# Altium schematic sheet OPV_psu.SchDoc: OPV Power supply
size A4; DrawnBy: Watzek; Organization: HTL Hollabrunn; Address1: Abteilung Elektronik; Address2: Anton Ehrenfried-Straße 10; Address3: 2020 Hollabrunn; DocumentNumber: 03; Revision: 01; SheetNumber: 03; SheetTotal: 12; SPICEModelCacheVBIYTPZR: <root> / <DocumentId>VBIYTPZR</DocumentId> / <CacheFrame Number="0"> / <Model Name="cap" Kind="MDL"> / <Text>*Default semiconductor capacitor / .MODEL CAP C()</Text> / </Model> / </CacheFrame> / </root>
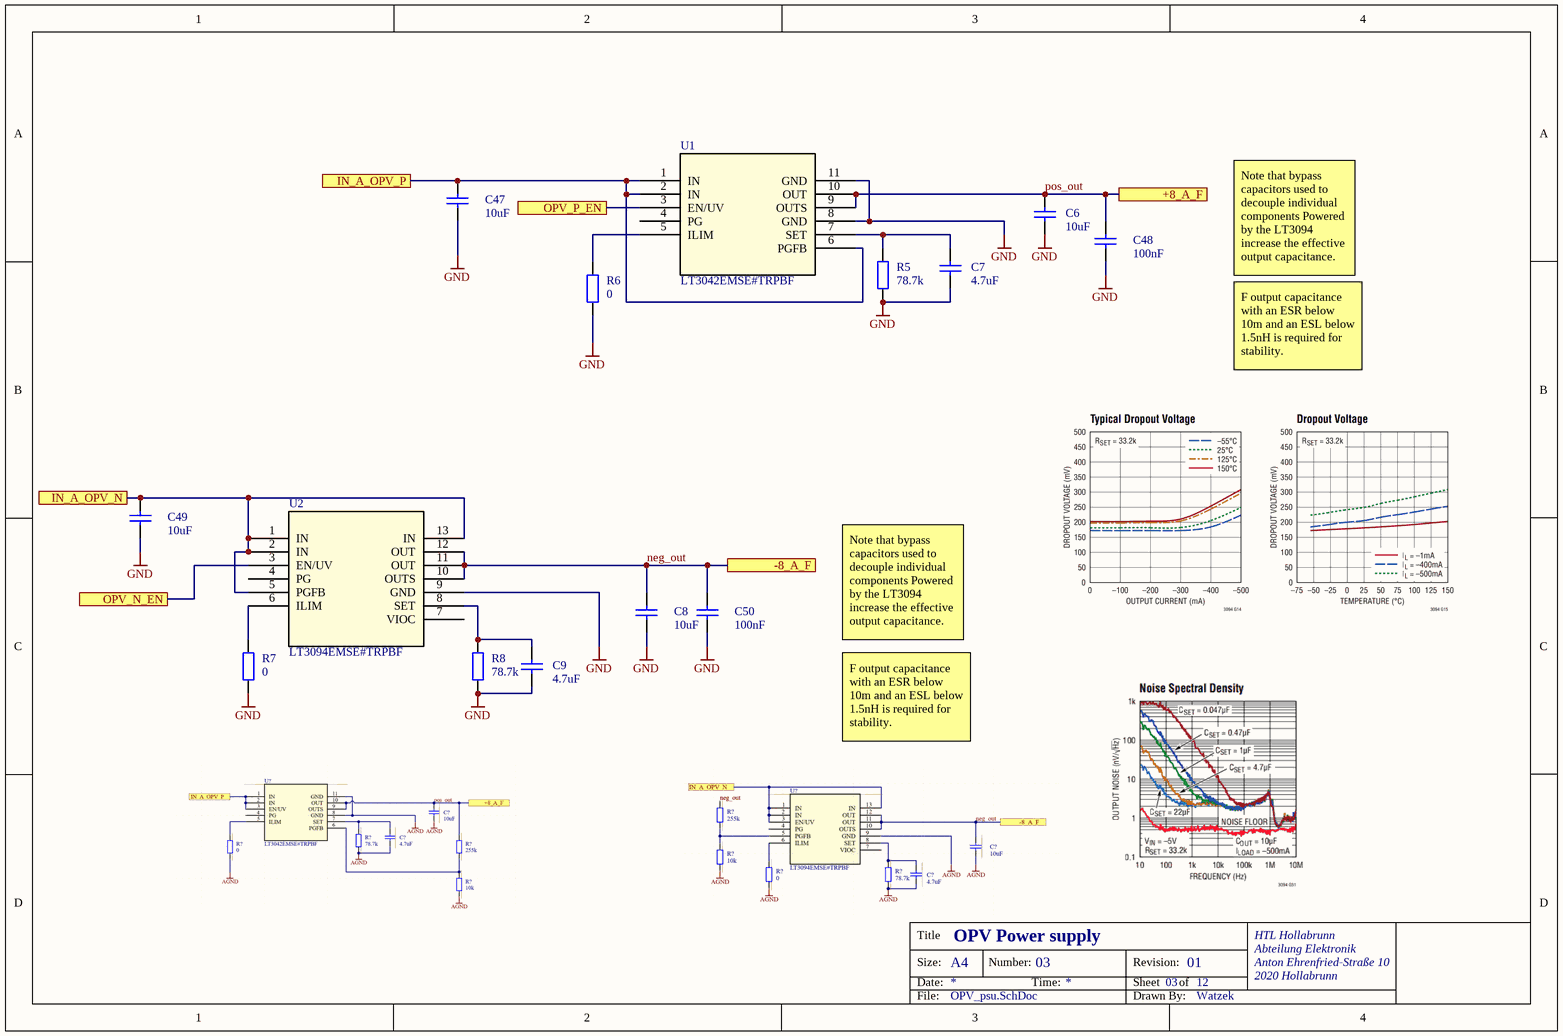
[diagram p0: OPV_psu.SchDoc]

## Parts
C6  10uF  [C1206-KUE]
C7  4.7uF  [C1206-KUE]
C8  10uF  [C1206-KUE]
C9  4.7uF  [C1206-KUE]
C47  10uF  [C1206-KUE]
C48  100nF  [C1206-KUE]
C49  10uF  [C1206-KUE]
C50  100nF  [C1206-KUE]
R5  78.7k  [C1206-KUE]
R6  0  [C1206-KUE]
R7  0  [C1206-KUE]
R8  78.7k  [C1206-KUE]
U1  LT3042EMSE#TRPBF  [05-08-1664_ADI]
U2  LT3094EMSE#TRPBF  [MSE_05-08-1666_ADI]

## Ports
+8_A_F, -8_A_F, IN_A_OPV_N, IN_A_OPV_P, OPV_N_EN, OPV_P_EN

## Nets
GND: C6.1 C7.1 C8.1 C9.1 C47.1 C48.1 C49.1 C50.1 R5.2 R6.2 R7.2 R8.2 U1.8(GND) U1.11(GND) U2.9(GND)
IN_A_OPV_N: C49.2 U2.1(IN) U2.2(IN) U2.5(PGFB) U2.13(IN) ; port IN_A_OPV_N
IN_A_OPV_P: C47.2 U1.1(IN) U1.2(IN) U1.6(PGFB) ; port IN_A_OPV_P
neg_out: C8.2 C50.2 U2.10(OUTS) U2.11(OUT) U2.12(OUT) ; port -8_A_F
OPV_N_EN: U2.3(EN/UV) ; port OPV_N_EN
OPV_P_EN: U1.3(EN/UV) ; port OPV_P_EN
pos_out: C6.2 C48.2 U1.9(OUTS) U1.10(OUT) ; port +8_A_F
NetC7_2: C7.2 R5.1 U1.7(SET)
NetC9_2: C9.2 R8.1 U2.8(SET)
NetR6_1: R6.1 U1.5(ILIM)
NetR7_1: R7.1 U2.6(ILIM)

Not connected (* = marked no-connect by the designer): U1 4(PG); U2 4(PG) 7(VIOC)

## Notes on the sheet
- Note that bypass capacitors used to decouple individual components Powered by the LT3094 increase the effective output capacitance.
- F output capacitance with an ESR below 10m and an ESL below 1.5nH is required for stability.
- Title
- Size:
- Date:
- A4
- Number:
- Time:
- Revision:
- Sheet
- of
- HTL Hollabrunn
- Abteilung Elektronik
- Anton Ehrenfried-Straße 10
- 2020 Hollabrunn
- File:
- Drawn By:

## Library data of the parts
C6-C9 C47-C50 = Capacitor: Manufacturer: Kemet; Bezeichnung: Kerko +-10% 63V; Published: 8-Jun-2000; LatestRevisionDate: 17-Jul-2002; LatestRevisionNote: Re-released for DXP Platform.; PackageReference: RAD-0.3; Publisher: Altium Limited; PackageDescription: Radial Cap, Thru-Hole; 2 Leads; 0.3 in Pin Spacing; Orderingcode: *
  C6 C8 C47 C49: Value: 10uF
  C7 C9: Value: 4.7uF
  C48 C50: Value: 100nF
R5-R8 = ResistorSMD: Resistor SMD; Manufacturer: AVX; Bezeichnung: SMD Wid. 1/8W 2%; Published: 8-Jun-2000; LatestRevisionDate: 17-Jul-2002; LatestRevisionNote: Re-released for DXP Platform.; PackageReference: AXIAL-0.4; Publisher: Altium Limited; PackageDescription: Axial Device, Thru-Hole; 2 Leads; 0.4 in Pin Spacing; Orderingcode: *
  R5 R8: Value: 78.7k
  R6 R7: Value: 0
U1 = LT3042EMSETRPBF: 20V, 200mA, Ultralow Noise, Ultrahigh PSRR RF Linear Regulator; Manufacturer_Name: Analog Devices Inc; Type: Power Management; Copyright: Copyright (C) 2025 Ultra Librarian. All rights reserved.; Manufacturer_Part_Number: LT3042EMSE#TRPBF; RefDes: RefDes
U2 = LT3094EMSETRPBF: âˆ’20V, 500mA, Ultralow Noise, Ultrahigh PSRR Negative Linear Regulator; Manufacturer_Name: Analog Devices Inc; Copyright: Copyright (C) 2025 Ultra Librarian. All rights reserved.; Manufacturer_Part_Number: LT3094EMSE#TRPBF; RefDes: RefDes; Type: Type